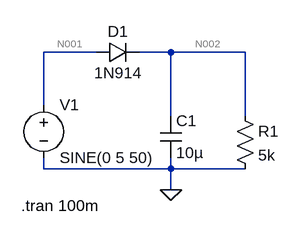
[diagram p0: schematic Lab2.asc]
Lab2.asc, the LTspice schematic file:
Version 4
SHEET 1 880 680
WIRE 80 64 0 64
WIRE 192 64 144 64
WIRE 304 64 192 64
WIRE 0 144 0 64
WIRE 192 160 192 64
WIRE 304 160 304 64
WIRE 0 240 0 224
WIRE 192 240 192 224
WIRE 192 240 0 240
WIRE 304 240 192 240
WIRE 192 272 192 240
FLAG 192 272 0
SYMBOL voltage 0 128 R0
WINDOW 123 0 0 Left 2
WINDOW 39 0 0 Left 2
SYMATTR InstName V1
SYMATTR Value SINE(0 5 50)
SYMBOL diode 80 80 R270
WINDOW 0 32 32 VTop 2
WINDOW 3 0 32 VBottom 2
SYMATTR InstName D1
SYMATTR Value 1N914
SYMBOL cap 176 160 R0
SYMATTR InstName C1
SYMATTR Value 10µ
SYMBOL res 288 144 R0
SYMATTR InstName R1
SYMATTR Value 5k
TEXT -34 296 Left 2 !.tran 100m

The netlist it stands for:
* Lab2.asc
V1 N001 0 SINE(0 5 50)
D1 N001 N002 1N914
C1 N002 0 10µ
R1 N002 0 5k
.model D D
.lib standard.dio
.tran 100m
.backanno
.end

* Results of the author's LTspice run, read from the files saved beside the schematic
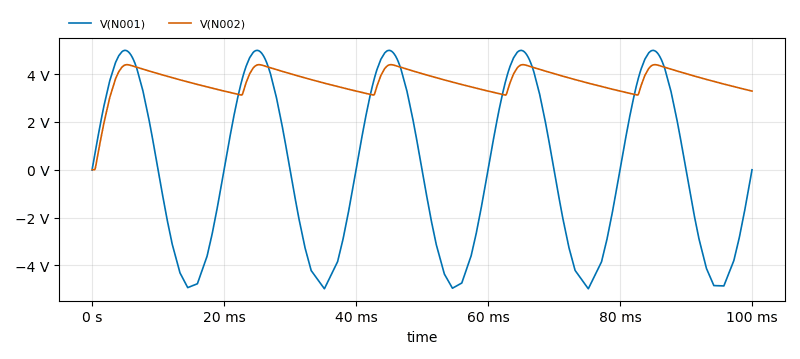
[diagram p1: Transient Analysis of Lab2.asc, plotted from the saved traces]
* Transient Analysis, 1 run:
*   V(N001): min -4.985 V, max 4.999 V, average 22.3 mV, rms 3.514 V, last 0 V
*   V(N002): min 0 V, max 4.4 V, average 3.712 V, rms 3.756 V, last 3.294 V